# Altium schematic sheet POWER.SchDoc
size A4
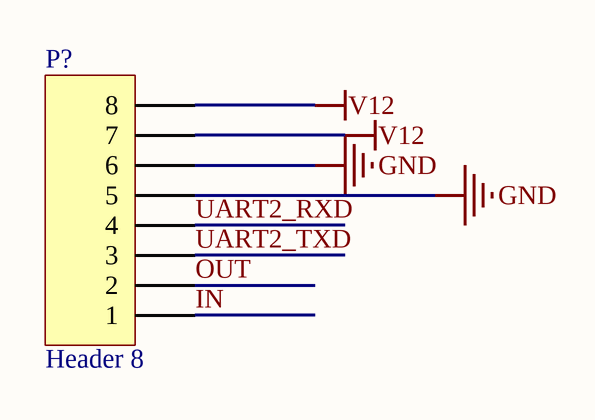
[diagram p0: POWER.SchDoc]

## Parts
P?  Header 8  [FPC1.0-2H-WS-8P]

## Nets
GND: P?.5 P?.6
V12: P?.7 P?.8
IN: P?.1
OUT: P?.2
UART2_RXD: P?.4
UART2_TXD: P?.3

## Library data of the parts
P? = Header 8: Header, 8-Pin; LatestRevisionDate: 17-Jul-2002; LatestRevisionNote: Re-released for DXP Platform.; Publisher: Altium Limited